# EAGLE design Aquila-2018-Under (EAGLE 9.1.1)
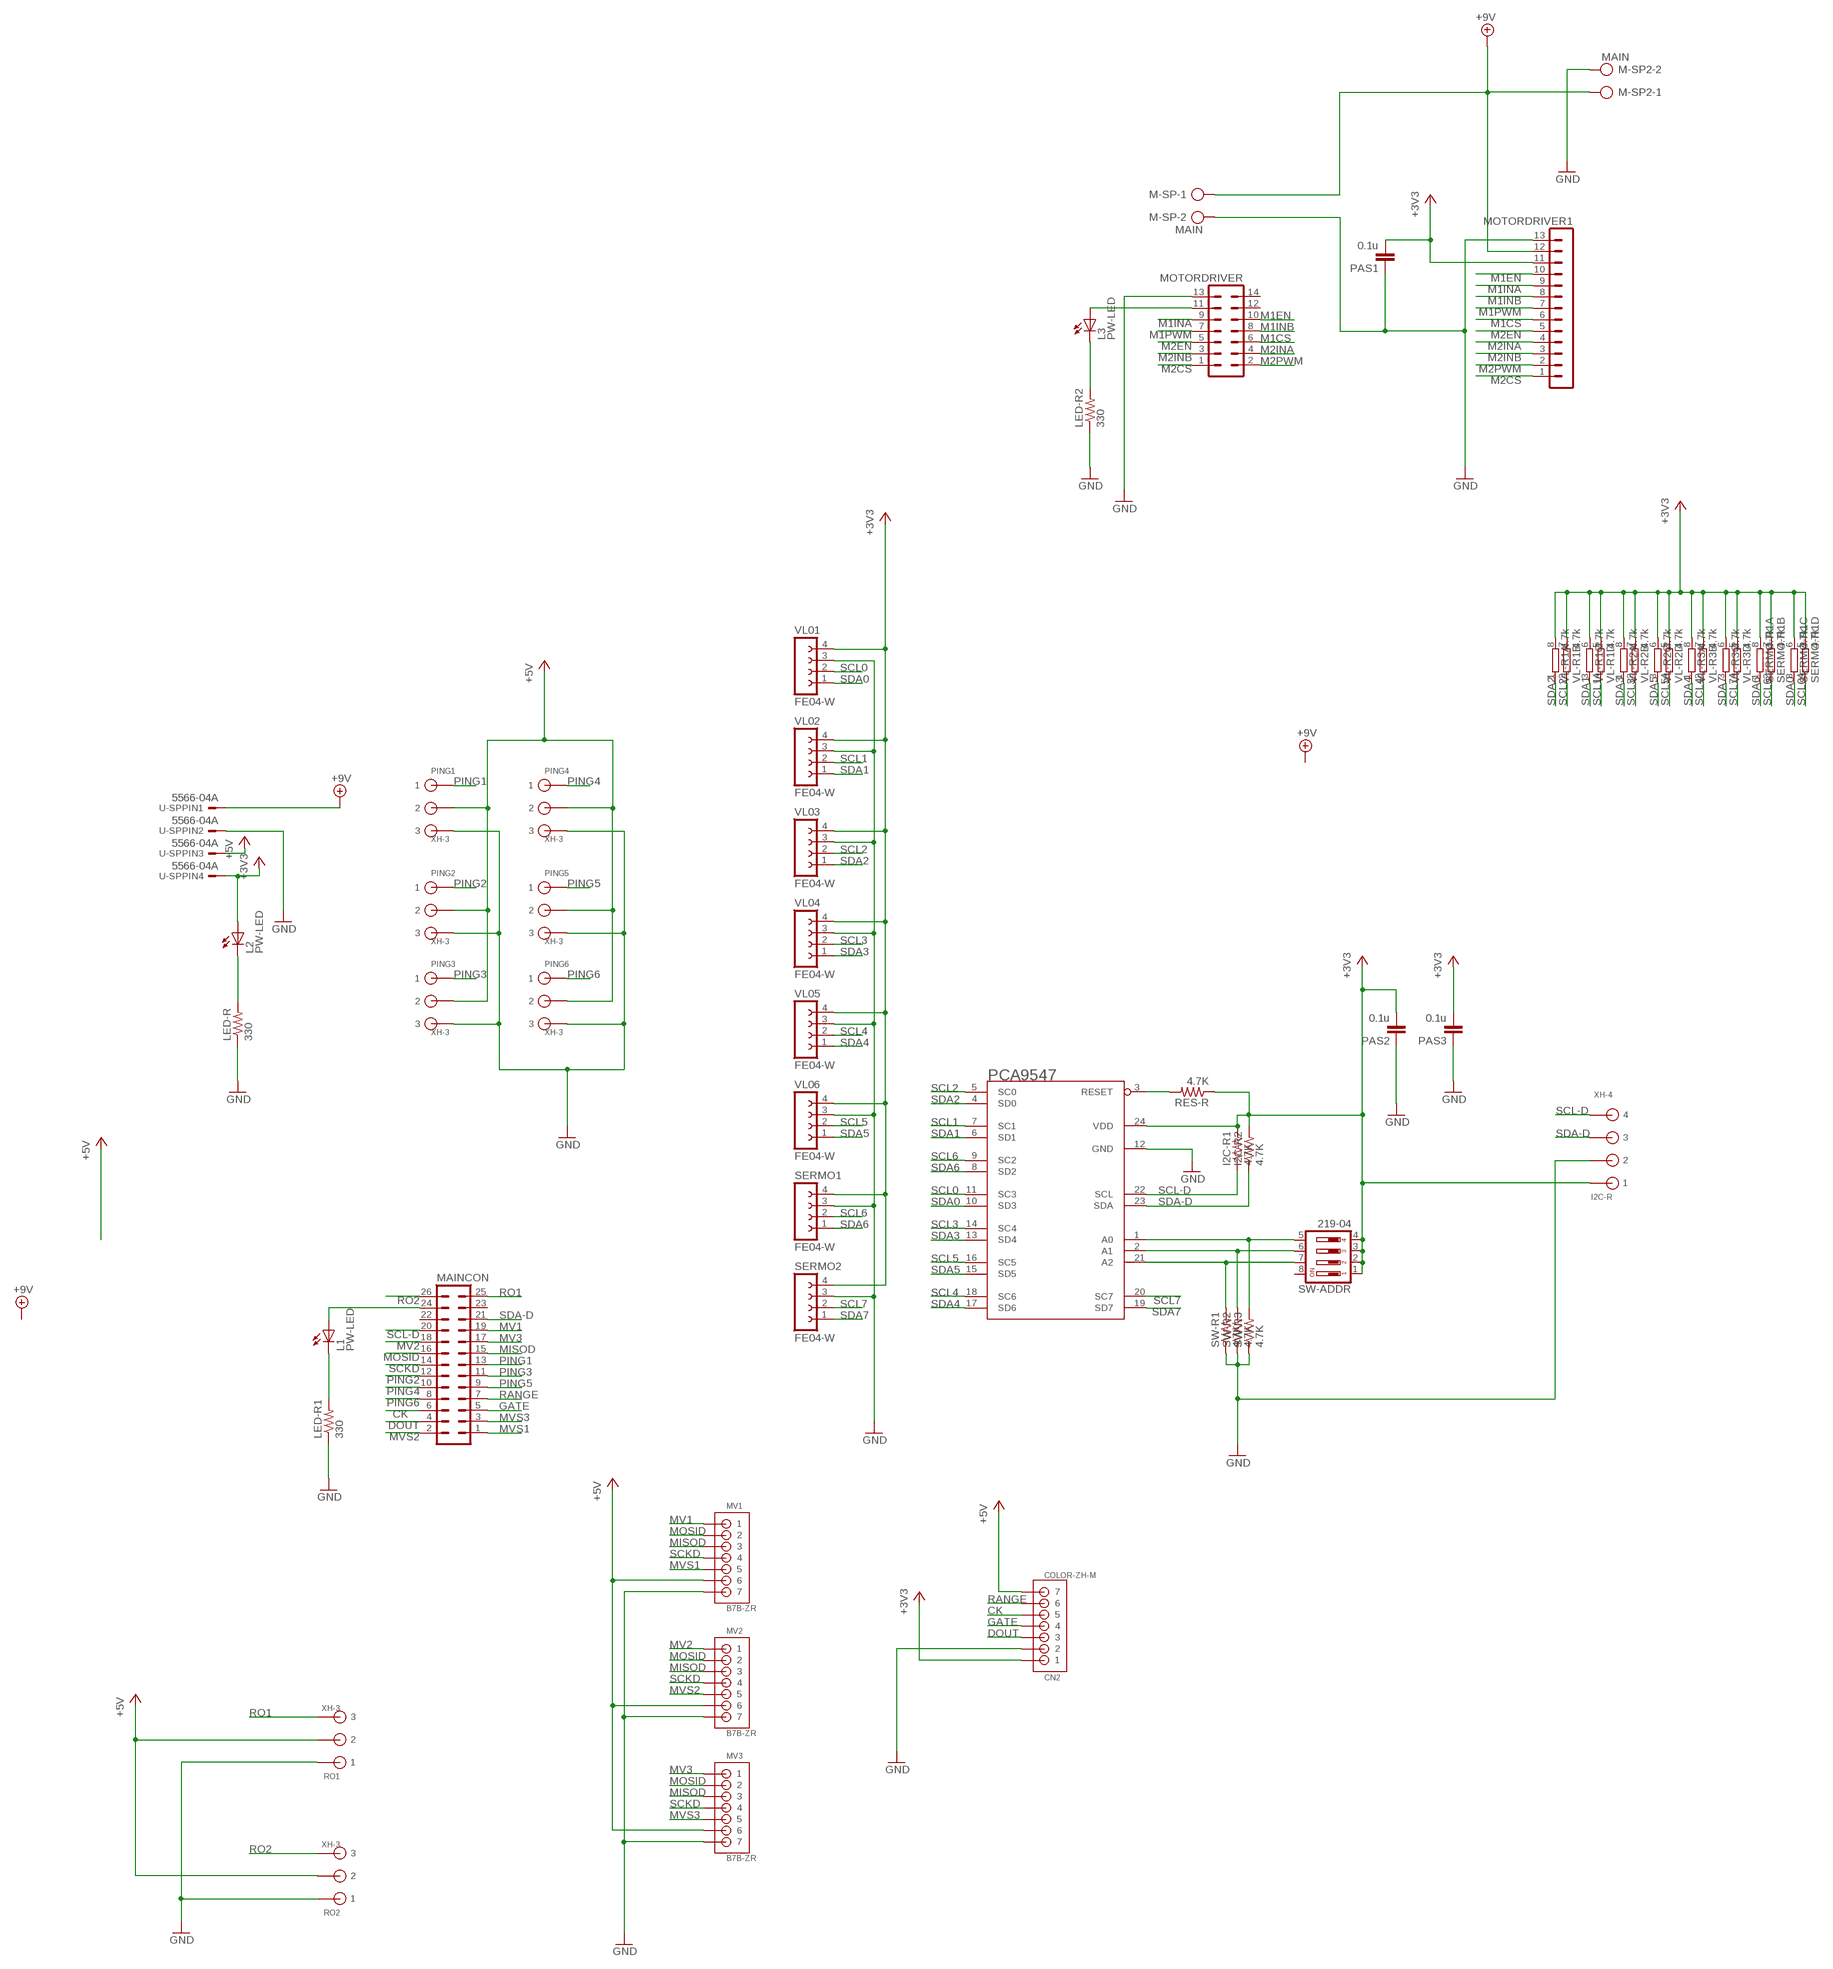
[diagram p0: schematic, sheet 1]

## Parts
CN2  COLOR-ZH-M  B7B-ZR  [B7B-ZR]
I2C-R  XH-4  [CON4]
I2C-R1  4.7K  R-US_R0805  [R0805]
I2C-R2  4.7K  R-US_R0805  [R0805]
L1  PW-LED  LEDCHIPLED_0805  [CHIPLED_0805]
L2  PW-LED  LEDCHIPLED_0805  [CHIPLED_0805]
L3  PW-LED  LEDCHIPLED_0805  [CHIPLED_0805]
LED-R  330  R-US_R0805  [R0805]
LED-R1  330  R-US_R0805  [R0805]
LED-R2  330  R-US_R0805  [R0805]
M-SP  MAIN  AK500/2  [AK500/2]
M-SP2  MAIN  AK500/2  [AK500/2]
MAINCON  ML26  [ML26]
MOTORDRIVER  ML14  [ML14]
MOTORDRIVER1  MA13-1  [MA13-1]
MV1  B7B-ZR  [B7B-ZR]
MV2  B7B-ZR  [B7B-ZR]
MV3  B7B-ZR  [B7B-ZR]
PAS1  0.1u  C-EUC0805  [C0805]
PAS2  0.1u  C-EUC0805  [C0805]
PAS3  0.1u  C-EUC0805  [C0805]
PCA9547  PCA9547  [SO24L]
PING1  XH-3  [CON3]
PING2  XH-3  [CON3]
PING3  XH-3  [CON3]
PING4  XH-3  [CON3]
PING5  XH-3  [CON3]
PING6  XH-3  [CON3]
RES-R  4.7K  R-US_R0805  [R0805]
RO1  XH-3  [CON3]
RO2  XH-3  [CON3]
SERMO1  FE04-W  [FE04-W]
SERMO2  FE04-W  [FE04-W]
SERMO-R1  4.7k  4R-NEXB28V  [EXB28V]
SW-ADDR  219-04  [CTS-219-04]
SW-R1  4.7K  R-US_R0805  [R0805]
SW-R2  4.7K  R-US_R0805  [R0805]
SW-R3  4.7K  R-US_R0805  [R0805]
U-SP  5566-04A  [5566-04A]
VL01  FE04-W  [FE04-W]
VL02  FE04-W  [FE04-W]
VL03  FE04-W  [FE04-W]
VL04  FE04-W  [FE04-W]
VL05  FE04-W  [FE04-W]
VL06  FE04-W  [FE04-W]
VL-R1  4.7k  4R-NEXB28V  [EXB28V]
VL-R2  4.7k  4R-NEXB28V  [EXB28V]
VL-R3  4.7k  4R-NEXB28V  [EXB28V]

## Nets
+3V3: CN2.1 I2C-R1.2 I2C-R2.2 I2C-R.P$1 L2.A MOTORDRIVER1.11 PAS1.2 PAS2.2 PAS3.2 PCA9547.24(VDD) RES-R.1 SERMO1.4 SERMO2.4 SERMO-R1.5 SERMO-R1.6 SERMO-R1.7 SERMO-R1.8 SW-ADDR.1 SW-ADDR.2 SW-ADDR.3 SW-ADDR.4 U-SP.4 VL01.4 VL02.4 VL03.4 VL04.4 VL05.4 VL06.4 VL-R1.5 VL-R1.6 VL-R1.7 VL-R1.8 VL-R2.5 VL-R2.6 VL-R2.7 VL-R2.8 VL-R3.5 VL-R3.6 VL-R3.7 VL-R3.8
+5V: CN2.7 MV1.6 MV2.6 MV3.6 PING1.P$2 PING2.P$2 PING3.P$2 PING4.P$2 PING5.P$2 PING6.P$2 RO1.P$2 RO2.P$2 U-SP.3
+9V: M-SP2.1 M-SP.1 MOTORDRIVER1.12 U-SP.1
CK: CN2.5 MAINCON.6
DOUT: CN2.3 MAINCON.4
GATE: CN2.4 MAINCON.5
GND: CN2.2 I2C-R.P$2 LED-R1.1 LED-R2.1 LED-R.1 M-SP2.2 M-SP.2 MOTORDRIVER1.13 MOTORDRIVER.13 MV1.7 MV2.7 MV3.7 PAS1.1 PAS2.1 PAS3.1 PCA9547.12(GND) PING1.P$3 PING2.P$3 PING3.P$3 PING4.P$3 PING5.P$3 PING6.P$3 RO1.P$1 RO2.P$1 SERMO1.3 SERMO2.3 SW-R1.1 SW-R2.1 SW-R3.1 U-SP.2 VL01.3 VL02.3 VL03.3 VL04.3 VL05.3 VL06.3
M1CS: MOTORDRIVER1.6 MOTORDRIVER.6
M1EN: MOTORDRIVER1.10 MOTORDRIVER.10
M1INA: MOTORDRIVER1.9 MOTORDRIVER.9
M1INB: MOTORDRIVER1.8 MOTORDRIVER.8
M1PWM: MOTORDRIVER1.7 MOTORDRIVER.7
M2CS: MOTORDRIVER1.1 MOTORDRIVER.1
M2EN: MOTORDRIVER1.5 MOTORDRIVER.5
M2INA: MOTORDRIVER1.4 MOTORDRIVER.4
M2INB: MOTORDRIVER1.3 MOTORDRIVER.3
M2PWM: MOTORDRIVER1.2 MOTORDRIVER.2
MISOD: MAINCON.15 MV1.3 MV2.3 MV3.3
MOSID: MAINCON.16 MV1.2 MV2.2 MV3.2
MV1: MAINCON.19 MV1.1
MV2: MAINCON.18 MV2.1
MV3: MAINCON.17 MV3.1
MVS1: MAINCON.1 MV1.5
MVS2: MAINCON.2 MV2.5
MVS3: MAINCON.3 MV3.5
N$1: PCA9547.1(A0) SW-ADDR.5 SW-R3.2
N$2: PCA9547.2(A1) SW-ADDR.6 SW-R2.2
N$3: PCA9547.21(A2) SW-ADDR.7 SW-R1.2
N$4: L2.C LED-R.2
N$5: PCA9547.3(RESET) RES-R.2
N$7: L1.C LED-R1.2
N$8: L1.A MAINCON.24
N$9: L3.C LED-R2.2
N$10: L3.A MOTORDRIVER.11
PING1: MAINCON.13 PING1.P$1
PING2: MAINCON.12 PING2.P$1
PING3: MAINCON.11 PING3.P$1
PING4: MAINCON.10 PING4.P$1
PING5: MAINCON.9 PING5.P$1
PING6: MAINCON.8 PING6.P$1
RANGE: CN2.6 MAINCON.7
RO1: MAINCON.25 RO1.P$3
RO2: MAINCON.26 RO2.P$3
SCKD: MAINCON.14 MV1.4 MV2.4 MV3.4
SCL0: PCA9547.11(SC3) SERMO-R1.4 VL01.2
SCL1: PCA9547.7(SC1) VL02.2 VL-R1.4
SCL2: PCA9547.5(SC0) VL03.2 VL-R1.2
SCL3: PCA9547.14(SC4) VL04.2 VL-R2.2
SCL4: PCA9547.18(SC6) VL05.2 VL-R3.2
SCL5: PCA9547.16(SC5) VL06.2 VL-R2.4
SCL6: PCA9547.9(SC2) SERMO1.2 SERMO-R1.2
SCL7: PCA9547.20(SC7) SERMO2.2 VL-R3.4
SCL-D: I2C-R1.1 I2C-R.P$4 MAINCON.20 PCA9547.22(SCL)
SDA0: PCA9547.10(SD3) SERMO-R1.3 VL01.1
SDA1: PCA9547.6(SD1) VL02.1 VL-R1.3
SDA2: PCA9547.4(SD0) VL03.1 VL-R1.1
SDA3: PCA9547.13(SD4) VL04.1 VL-R2.1
SDA4: PCA9547.17(SD6) VL05.1 VL-R3.1
SDA5: PCA9547.15(SD5) VL06.1 VL-R2.3
SDA6: PCA9547.8(SD2) SERMO1.1 SERMO-R1.1
SDA7: PCA9547.19(SD7) SERMO2.1 VL-R3.3
SDA-D: I2C-R2.1 I2C-R.P$3 MAINCON.21 PCA9547.23(SDA)
Unconnected: MAINCON.22 MAINCON.23 MOTORDRIVER.12 MOTORDRIVER.14 SW-ADDR.8

## Library data of the parts
CN2 MV1-MV3 = jst:B7B-ZR
I2C-R = 0@Mylibrary-main1:XH-4: Low insertion connector 4pin
I2C-R1 I2C-R2 LED-R LED-R1 LED-R2 RES-R SW-R1-SW-R3 = 0@Mylibrary-main1:R-US_: RESISTOR, American symbol
L1-L3 = led:LED: LED OSRAM: - CHIPLED LG R971, LG N971, LY N971, LG Q971, LY Q971, LO R971, LY R971 LH N974, LH R974 LS Q976, LO Q976, LY Q976 LO Q996 - Hyper CHIPLED LW Q18S LB Q993, LB Q99A, LB R99A - SideLED LS A670, LO A670, LY A670, LG A670, LP A670 LB A673, LV A673, LT A673, LW A673 LH A674 LY A675 LS A676, LA A676, LO A676, LY A676, LW A676 LS A679, LY A679, LG A679 - Hyper Micro SIDELED® LS Y876, LA Y876, LO Y876, LY Y876 LT Y87S - SmartLED LW L88C, LW L88S LB L89C, LB L89S, LG L890 LS L89K, LO L89K, LY L89K LS L896, LA L896, LO L896, LY L896 - TOPLED LS T670, LO T670, LY T670, LG T670, LP T670 LSG T670, LSP T670, LSY T670, LOP T670, LYG T670 LG T671, LOG T671, LSG T671 LB T673, LV T673, LT T673, LW T673 LH T674 LS T676, LA T676, LO T676, LY T676, LB T676, LH T676, LSB T676, LW T676 LB T67C, LV T67C, LT T67C, LS T67K, LO T67K, LY T67K, LW E67C LS E67B, LA E67B, LO E67B, LY E67B, LB E67C, LV E67C, LT E67C LW T67C LS T679, LY T679, LG T679 LS T770, LO T770, LY T770, LG T770, LP T770 LB T773, LV T773, LT T773, LW T773 LH T774 LS E675, LA E675, LY E675, LS T675 LS T776, LA T776, LO T776, LY T776, LB T776 LHGB T686 LT T68C, LB T68C - Hyper Mini TOPLED® LB M676 - Mini TOPLED Santana® LG M470 LS M47K, LO M47K, LY M47K Source: http://www.osram.convergy.de LUXEON: - LUMILED® LXK2-PW12-R00, LXK2-PW12-S00, LXK2-PW14-U00, LXK2-PW14-V00 LXK2-PM12-R00, LXK2-PM12-S00, LXK2-PM14-U00 LXK2-PE12-Q00, LXK2-PE12-R00, LXK2-PE12-S00, LXK2-PE14-T00, LXK2-PE14-U00 LXK2-PB12-K00, LXK2-PB12-L00, LXK2-PB12-M00, LXK2-PB14-N00, LXK2-PB14-P00, LXK2-PB14-Q00 LXK2-PR12-L00, LXK2-PR12-M00, LXK2-PR14-Q00, LXK2-PR14-R00 LXK2-PD12-Q00, LXK2-PD12-R00, LXK2-PD12-S00 LXK2-PH12-R00, LXK2-PH12-S00 LXK2-PL12-P00, LXK2-PL12-Q00, LXK2-PL12-R00 Source: www.luxeon.com KINGBRIGHT: KA-3528ASYC Source: www.kingbright.com
M-SP M-SP2 = con-ptr500:AK500/2: CONNECTOR; OC_FARNELL: unknown; OC_NEWARK: unknown
MAINCON = 0con-harting-ml:ML26: HARTING; OC_FARNELL: unknown; OC_NEWARK: unknown
MOTORDRIVER = 0con-harting-ml:ML14: HARTING; OC_FARNELL: unknown; OC_NEWARK: unknown
MOTORDRIVER1 = con-lstb-forprint:MA13-1: PIN HEADER; OC_FARNELL: unknown; OC_NEWARK: unknown
PAS1-PAS3 = rcl:C-EU: CAPACITOR, European symbol; SPICEPREFIX: B
PCA9547 = PCA9547:PCA9547: 8-channel I2C-Bus multiplexer with reset NXP
PING1-PING6 = 0@Mylibrary-main1:XH-3: low insertion CON
RO1 RO2 = forprint:XH-3: low insertion CON
SERMO1 SERMO2 VL01-VL06 = 0@con-lsta:FE04-W
SERMO-R1 VL-R1-VL-R3 = resistor-dil:4R-N: Array Chip Resistor Source: RS Component / Phycomp; OC_FARNELL: unknown; OC_NEWARK: unknown
SW-ADDR = switch-dil:219-04*: Surface Mount DIP Switch Series 219 SMT CTS Electronic Components Sourc: www.ctscorp.com; OC_FARNELL: unknown; OC_NEWARK: unknown
U-SP = con-molex:5566-04A

## Board
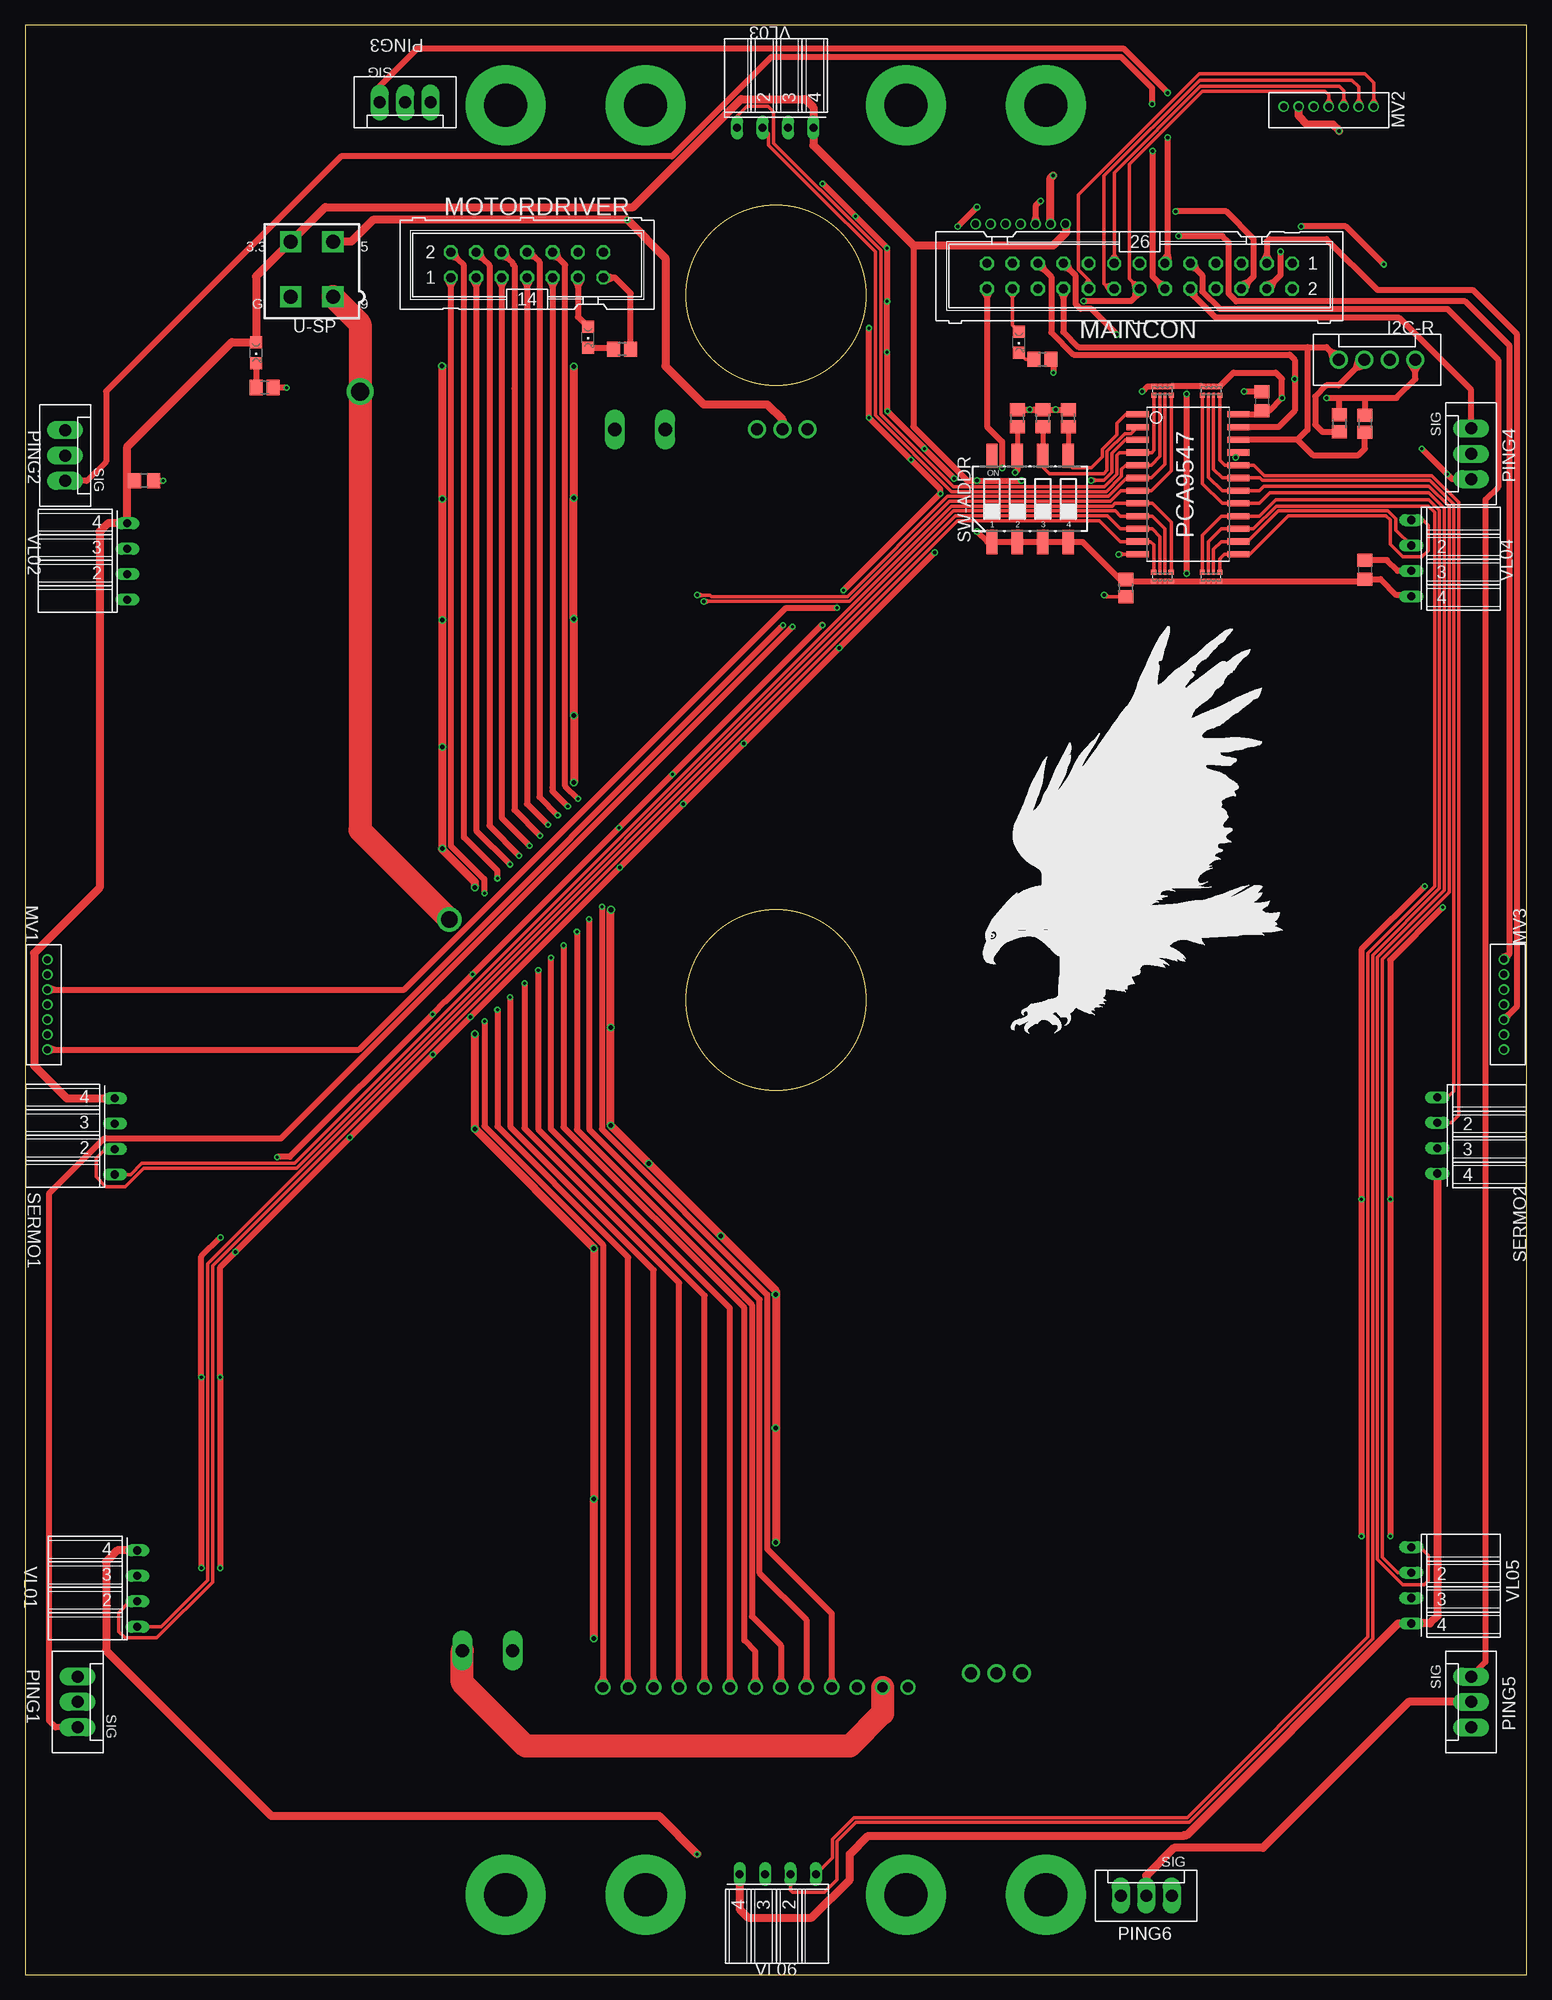
[diagram p1: board, top side]
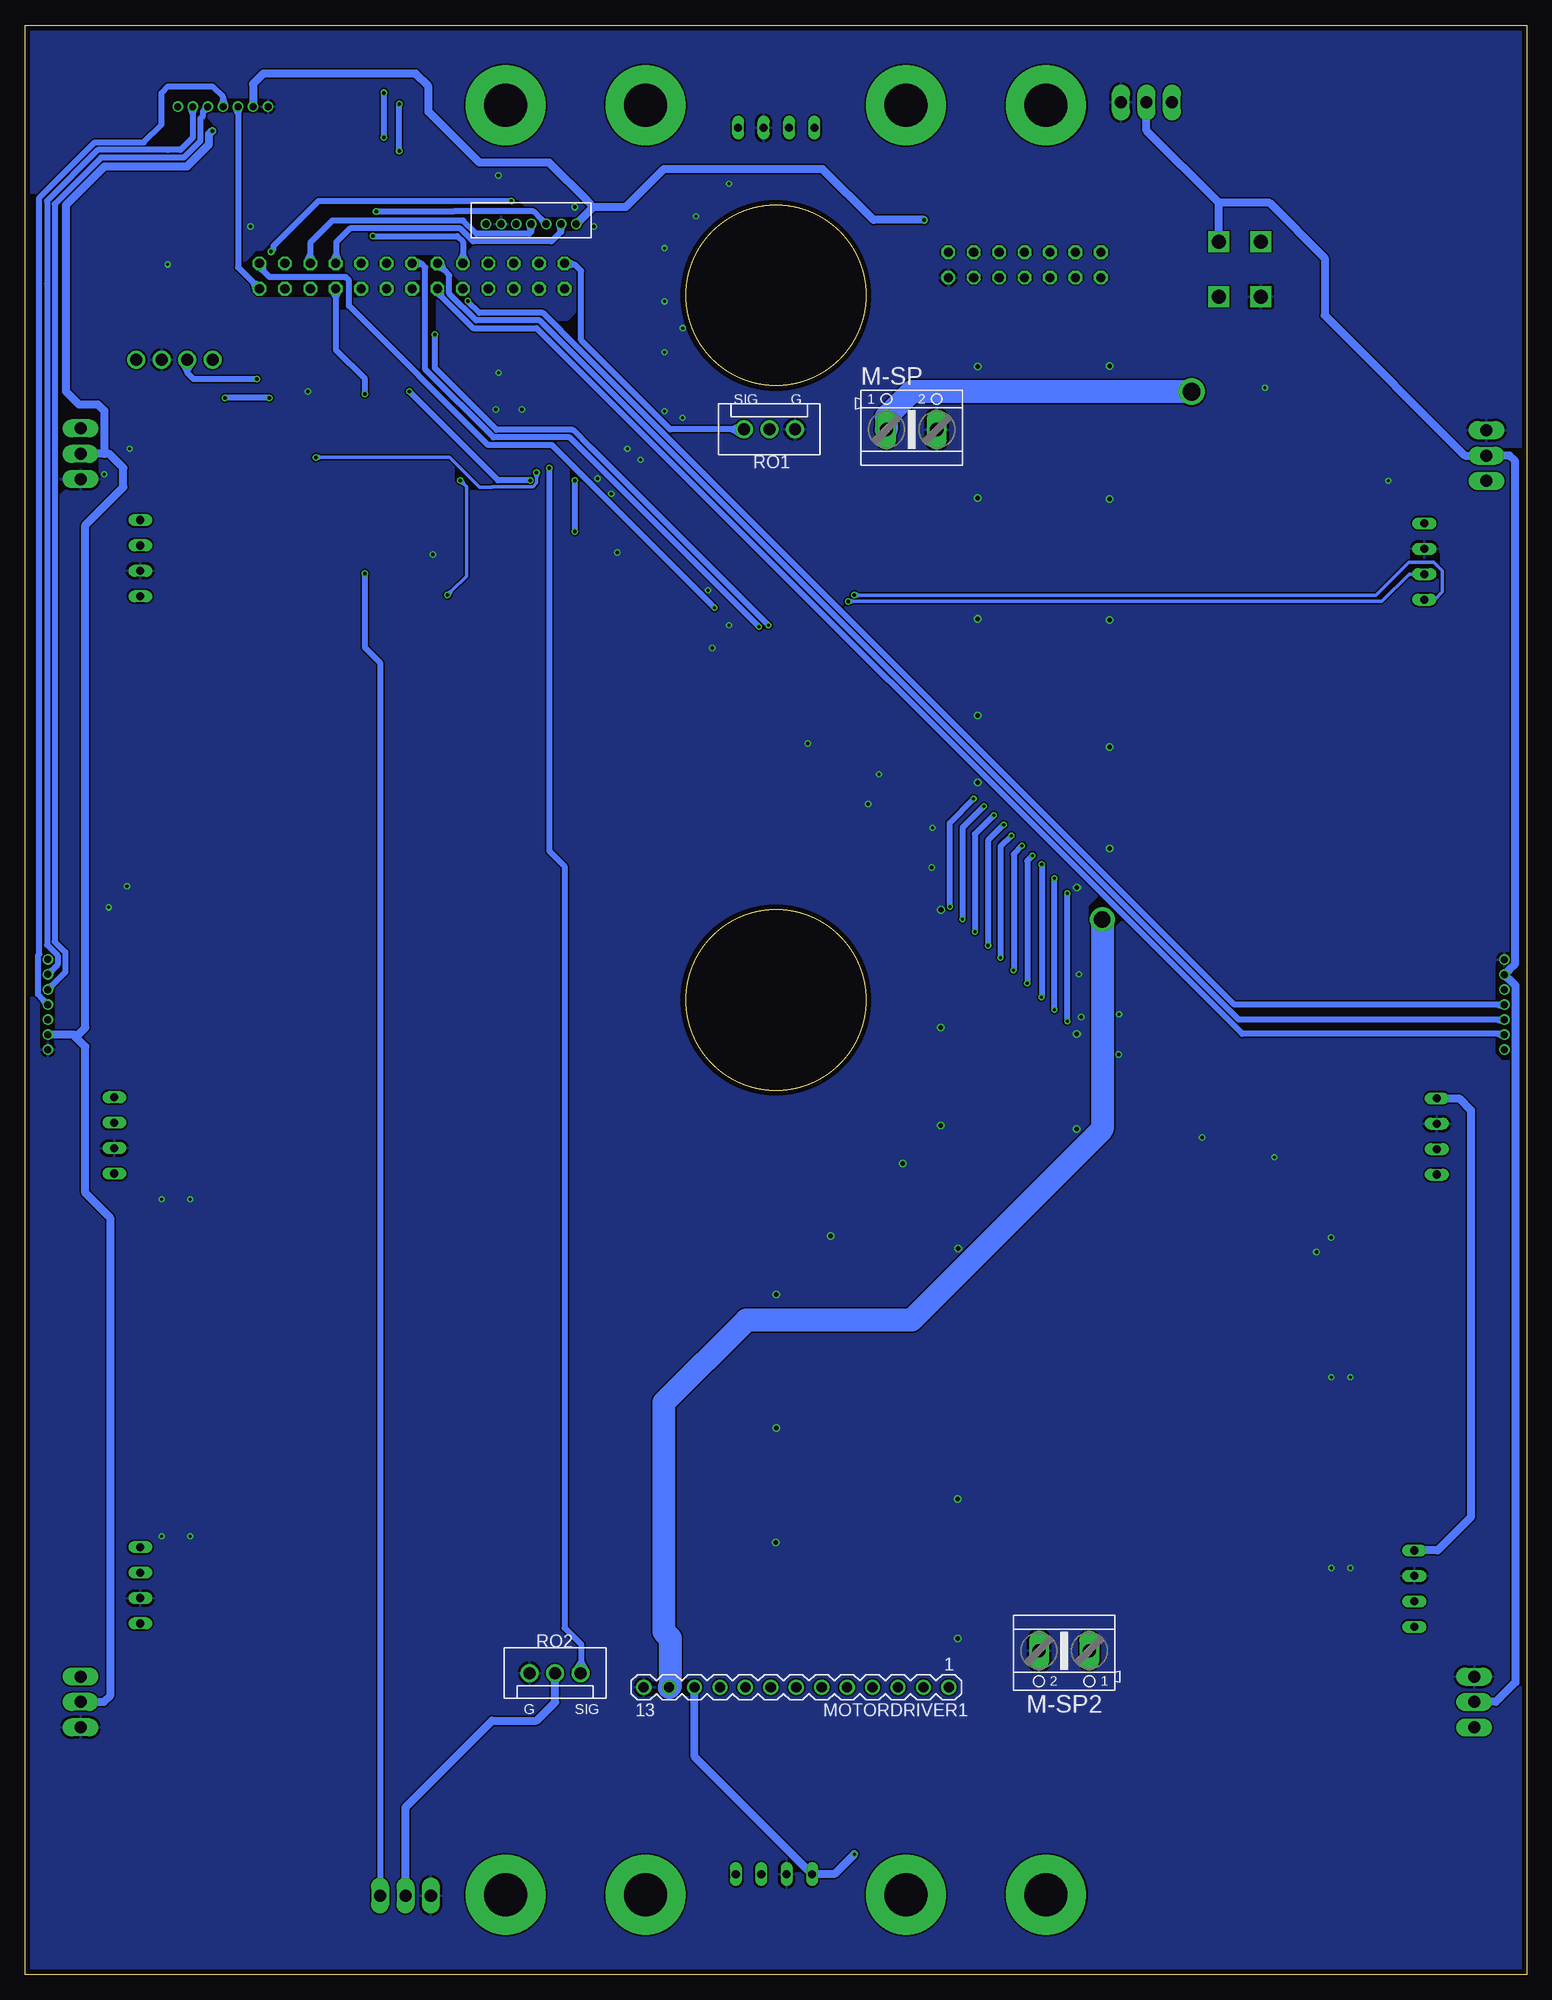
[diagram p2: board, bottom side, seen from below]

Size 150 x 194.72 mm. Coordinates in mm from the lower left corner, seen from the top.
Outline: 0,0 150,0 150,194.72 0,194.72 0,0
Outline: circle at 75,97.36 radius 9
Outline: circle at 75,167.72 radius 9
Copper layers (1*16): Top 0.035mm / dielectric 1.6mm / Bottom 0.035mm
Design rules "Elecrow_2-layer_PCB_eagle_rule": minimum track width 6mil, minimum drill 12mil, track to track 6mil, track to pad 6mil, pad to pad 6mil, via to via 8mil, smd to smd 0mil, copper to edge 20mil, drill to drill 10mil, minimum pad ring 6mil, minimum via ring 6mil, stop-mask expansion 0mil, vias tented up to drill 100mil, thermal gap 10mil
bRestrict: 69 lines

### Footprints (pad centres in the part's own frame; a part is rotated, then mirrored left to right if it is on the bottom)
B7B-ZR = drill 0.7: 1 10.5,-1.3; 2 9,-1.3; 3 7.5,-1.3; 4 6,-1.3; 5 4.5,-1.3; 6 3,-1.3; 7 1.5,-1.3
CON4 = drill 1.2: P$1 -3.81,0; P$2 -1.27,0; P$3 1.27,0; P$4 3.81,0
R0805 = smd 1.3 x 1.5: 1 -0.85,0; 2 0.85,0
CHIPLED_0805 = smd 1.2 x 1.2: A 0,-1.05; C 0,1.05
AK500/2 = drill 1.321 long: 1 -2.515,0; 2 2.515,0
ML26 = drill 0.914 octagon: 1 -15.24,-1.27; 2 -15.24,1.27; 3 -12.7,-1.27; 4 -12.7,1.27; 5 -10.16,-1.27; 6 -10.16,1.27; 7 -7.62,-1.27; 8 -7.62,1.27; 9 -5.08,-1.27; 10 -5.08,1.27; 11 -2.54,-1.27; 12 -2.54,1.27; 13 0,-1.27; 14 0,1.27; 15 2.54,-1.27; 16 2.54,1.27; 17 5.08,-1.27; 18 5.08,1.27; 19 7.62,-1.27; 20 7.62,1.27; 21 10.16,-1.27; 22 10.16,1.27; 23 12.7,-1.27; 24 12.7,1.27; 25 15.24,-1.27; 26 15.24,1.27
ML14 = drill 0.914 octagon: 1 -7.62,-1.27; 2 -7.62,1.27; 3 -5.08,-1.27; 4 -5.08,1.27; 5 -2.54,-1.27; 6 -2.54,1.27; 7 0,-1.27; 8 0,1.27; 9 2.54,-1.27; 10 2.54,1.27; 11 5.08,-1.27; 12 5.08,1.27; 13 7.62,-1.27; 14 7.62,1.27
MA13-1 = drill 1.016: 1 -15.24,0; 2 -12.7,0; 3 -10.16,0; 4 -7.62,0; 5 -5.08,0; 6 -2.54,0; 7 0,0; 8 2.54,0; 9 5.08,0; 10 7.62,0; 11 10.16,0; 12 12.7,0; 13 15.24,0
C0805 = smd 1.3 x 1.5: 1 -0.95,0; 2 0.95,0
SO24L = smd 0.61 x 2.21: 1 -6.985,-5.029; 2 -5.715,-5.029; 3 -4.445,-5.029; 4 -3.175,-5.029; 5 -1.905,-5.029; 6 -0.635,-5.029; 7 0.635,-5.029; 8 1.905,-5.029; 9 3.175,-5.029; 10 4.445,-5.029; 11 5.715,-5.029; 12 6.985,-5.029; 13 6.985,5.029; 14 5.715,5.029; 15 4.445,5.029; 16 3.175,5.029; 17 1.905,5.029; 18 0.635,5.029; 19 -0.635,5.029; 20 -1.905,5.029; 21 -3.175,5.029; 22 -4.445,5.029; 23 -5.715,5.029; 24 -6.985,5.029
CON3 = drill 1.2 long: P$1 -2.54,0; P$2 0,0; P$3 2.54,0
CON3' = drill 1.2: P$1 -2.54,0; P$2 0,0; P$3 2.54,0
FE04-W = drill 0.813 long: 1 1.27,-1.27; 2 3.81,-1.27; 3 6.35,-1.27; 4 8.89,-1.27
EXB28V = smd 0.525 x 0.5: 1 -0.875,-0.45; 4 0.875,-0.45; 5 0.875,0.45; 8 -0.875,0.45 | smd 0.25 x 0.5: 2 -0.25,-0.45; 3 0.25,-0.45; 6 0.25,0.45; 7 -0.25,0.45
CTS-219-04 = smd 1.13 x 2.44: 1 -3.81,-4.3; 2 -1.27,-4.3; 3 1.27,-4.3; 4 3.81,-4.3; 5 3.81,4.3; 6 1.27,4.3; 7 -1.27,4.3; 8 -3.81,4.3
5566-04A = drill 1.4 square: 1 2.1,-2.75; 2 -2.1,-2.75; 3 2.1,2.75; 4 -2.1,2.75

### Placement (x,y rotation side)
CN2  93.44,173.55 180 bottom
I2C-R  135.06,161.31 180 top
I2C-R1  133.86,154.93 90 top
I2C-R2  131.28,154.94 90 top
L1  99.28,163.07 180 top
L2  23.08,162.01 180 top
L3  56.24,163.53 180 top
LED-R  23.93,158.53 180 top
LED-R1  101.64,161.34 180 top
LED-R2  59.66,162.37 180 top
M-SP  61.44,154.33 0 bottom
M-SP2  46.2,32.38 180 bottom
MAINCON  111.34,169.65 180 top
MOTORDRIVER  50.15,170.77 0 top
MOTORDRIVER1  72.96,28.73 180 bottom
MV1  3.53,102.9 270 top
MV2  124.23,187.88 0 top
MV3  146.42,90.91 90 top
PAS1  133.82,140.34 270 top
PAS2  123.56,157.16 270 top
PAS3  11.9,149.22 180 top
PCA9547  116.17,148.86 270 top
PING1  5.25,27.26 90 top
PING2  4.01,151.73 90 top
PING3  37.97,187 0 top
PING4  144.45,151.91 270 top
PING5  144.45,27.26 270 top
PING6  112,7.92 180 top
RES-R  109.97,138.5 270 top
RO1  XH-3  [CON3']  75.64,154.35 180 bottom
RO2  XH-3  [CON3']  97.05,30.15 0 bottom
SERMO1  7.7,78.66 90 top
SERMO2  142.35,88.92 270 top
SERMO-R1  113.62,139.63 180 top
SW-ADDR  100.39,147.41 0 top
SW-R1  99.12,155.47 270 top
SW-R2  101.66,155.47 270 top
SW-R3  104.21,155.47 270 top
U$1  [EAGLE-PLC-30MM]  95.72,93.98 0 top
U-SP  28.66,170.34 0 top
VL01  9.95,33.5 90 top
VL02  8.95,136.07 90 top
VL03  69.87,185.75 0 top
VL04  139.75,146.56 270 top
VL05  139.75,43.99 270 top
VL06  80.27,8.8 180 top
VL-R1  113.63,158.2 0 top
VL-R2  118.47,139.62 180 top
VL-R3  118.48,158.2 0 top

### Tracks (layer width: path | path; a pad name or v marks a point on that pad's centre or on a via)
+3V3  (via drill 0.3, 0.35)
  Top 0.33: PAS3.2 10.22,149.22
  Top 0.61: VL-R2.5 114.51,139.17 SERMO-R1.8 SERMO-R1.7 SERMO-R1.6 SERMO-R1.5 110.14,139.18 RES-R.1 109.41,139.35 105.64,143.12 SW-ADDR.4 SW-ADDR.3 SW-ADDR.2 97.63,143.12 97,143.12 | VL-R2.5 VL-R2.6 VL-R2.8 133.61,139.17 PAS1.2 135.41,139.38 137,137.79 138.35,137.79 VL04.4 | VL-R2.5 VL-R2.7 | VL-R1.8 112.87,158.65 | 112.87,158.65 VL-R1.7 | VL-R1.7 VL-R1.6 | VL-R1.7 VL-R1.5 VL-R3.8 VL-R3.7 VL-R3.6 VL-R3.5 120.73,160.02 124.94,160.02 125.57,159.38 v125.57,157.48 124.3,156.21 PAS2.2 123.2,155.84 PCA9547.24 | SW-ADDR.1 97,143.12 | 138.87,160.11 138.87,159.42 138.91,159.38 137,157.48 133.82,157.48 | 138.87,160.11 I2C-R.P$1 | v130.01,157.48 131.28,157.48 | 131.28,157.48 133.82,157.48 | I2C-R2.2 131.28,157.48 | 133.82,157.48 133.86,157.45 I2C-R1.2 | v111.6,158.12 112.13,158.65 112.87,158.65 | 88.74,172.72 88.74,154.62 94.12,149.24 94.45,149.24 | v99.53,149.26 99.51,149.24 94.45,149.24 | 94.45,149.24 95.07,149.24 v95.09,149.26 | v95.09,144.15 96.12,143.12 97,143.12 | 138.87,160.11 139.39,161.02 I2C-R.P$1 | 138.87,160.11 138.35,161.02 I2C-R.P$1
  Top 0.813: SERMO1.4 4.17,87.55 0.91,90.81 0.91,102.04 7.46,108.58 7.46,144.15 8.28,144.96 VL02.4 10.22,149.22 10.22,152.62 20.66,163.06 L2.A 23.08,169.62 U-SP.4 29.99,176.53 60.75,176.53 71.55,187.32 77.94,187.32 78.76,186.51 VL03.4 78.76,182.7 84.3,177.16 | VL01.4 9.21,42.39 8.1,41.27 8.1,32.38 24.61,15.88 63.34,15.88 v67.15,12.06 | VL06.4 71.38,6.57 72.23,5.71 78.58,5.71 82.39,9.53 82.39,12.06 84.21,13.88 115.71,13.88 115.8,13.97 116.05,13.97 137.18,35.1 VL05.4 140.35,35.1 141.08,35.83 SERMO2.4 | CN2.1 103.98,174.82 103.98,173.99 102.71,172.72 88.74,172.72 | 84.3,177.16 | 84.3,177.16 88.74,172.72 | 88.74,172.72
  Bottom 0.61: v125.57,157.48 v130.01,157.48 | v111.6,158.12 102.75,149.26 v99.53,149.26 | v95.09,149.26 v95.09,144.15
  Bottom 0.813: SERMO1.4 6.75,87.55 5.55,86.36 5.55,45.72 8.88,42.39 VL01.4 | v67.15,12.06 69.15,10.07 VL06.4 83.12,21.81 MOTORDRIVER1.11
+5V  (via drill 0.35)
  Top 0.813: PING5.P$2 138.22,27.26 123.67,12.7 114.78,12.7 112,9.93 PING6.P$2 | U-SP.3 32.6,173.09 34.77,175.26 v60.16,175.26 63.98,171.45 63.98,160.66 67.78,156.84 74.14,156.84 75.64,155.34 RO1.P$2 | MV2.6 127.23,185.66 128.11,184.78 130.65,184.78 v131.28,184.15
  Bottom 0.813: U-SP.3 30.75,176.97 | PING3.P$2 37.97,184.18 30.75,176.97 | 30.75,176.97 25.68,176.97 20.16,171.45 20.16,165.74 6.16,151.73 PING2.P$2 1.71,151.73 1.15,151.17 1.15,100.95 1.78,100.32 1.81,100.32 MV1.6 1.81,99.48 1.78,99.48 1.11,98.81 1.11,29.21 3.06,27.26 PING1.P$2 | PING5.P$2 142.12,27.26 141.44,27.94 141.44,75.56 143.99,78.11 143.99,92.71 145.19,93.91 | 145.19,93.91 MV3.6 | 145.19,93.91 144.69,93.91 143.99,94.61 143.99,144.78 140.18,148.59 140.18,150.5 141.59,151.91 142.08,151.91 | 142.08,151.91 PING4.P$2 | MV2.6 127.23,188.84 126.2,189.87 110.97,189.87 109.69,188.59 109.69,186.06 104.61,180.97 97.63,180.97 93.82,177.16 93.19,176.53 | 142.08,151.91 142.08,156.21 142.72,156.84 144.62,156.84 145.89,158.12 145.89,176.77 142.04,180.62 133.79,180.62 131.6,182.8 131.6,183.83 v131.28,184.15 | CN2.7 93.27,176.53 93.19,176.53 | RO2.P$2 97.05,27.25 98.9,25.4 103.34,25.4 112,16.75 PING6.P$2 | v60.16,175.26 65.25,175.26 70.33,180.34 86.2,180.34 90.01,176.53 93.19,176.53
+9V  (via drill 1.65, 1.78)
  Top 2.286: U-SP.1 33.47,164.88 v33.47,158.12 33.47,114.33 | 33.47,114.33 | v42.38,105.41 33.47,114.33 | MOTORDRIVER1.12 85.66,26.13 82.39,22.86 50.01,22.86 43.68,29.18 M-SP2.1
  Bottom 2.286: 86.2,43.81 86.2,57.15 77.94,65.41 61.44,65.41 42.38,84.45 v42.38,105.41 | 86.2,43.81 | 86.2,43.81 86.2,34.29 85.56,33.66 85.56,28.82 MOTORDRIVER1.12 | v33.47,158.12 61.44,158.12 63.95,155.6 M-SP.1
CK  (via drill 0.35)
  Top 0.61: v114.92,176.11 119.98,176.11 122.72,173.37 122.72,169.6 122.15,169.03 | 122.15,169.03 MAINCON.6 | 122.15,169.03 121.37,168.74 MAINCON.6 | 122.15,169.03 121.86,168.25 MAINCON.6
  Bottom 0.61: v114.92,176.11 107.16,176.11 99.2,176.11 98.44,175.35 | CN2.5 98.44,175.35 | 98.44,175.35 97.84,175.05 CN2.5 | 98.44,175.35 98.14,174.76 CN2.5
DOUT  (via drill 0.35)
  Top 0.61: v125.41,172.09 125.41,169.75 124.69,169.03 | 124.69,169.03 MAINCON.4 | v101.44,177.16 100.94,176.67 100.94,175.56 | 100.94,175.56 CN2.3 | 124.69,169.03 123.91,168.74 MAINCON.4 | 124.69,169.03 124.4,168.25 MAINCON.4 | 100.94,175.56 100.73,174.92 CN2.3 | 100.94,175.56 101.15,174.92 CN2.3
  Bottom 0.61: v125.41,172.09 125.18,172.32 125.18,172.66 120.68,177.16 v101.44,177.16
GATE
  Bottom 0.61: 121.5,171.83 121.5,172.98 119.3,175.18 106.22,175.18 104.91,173.87 99.65,173.87 99.44,174.08 99.44,174.16 | 121.5,171.83 MAINCON.5 | CN2.4 99.44,174.16 | 121.5,171.83 121.15,171.08 MAINCON.5 | 121.5,171.83 121.85,171.08 MAINCON.5 | 99.44,174.16 99.65,174.78 CN2.4 | 99.44,174.16 99.23,174.78 CN2.4
GND  (via drill 0.3, 0.35, 0.45, 0.5)
  Top 0.33: PCA9547.12 109.79,141.88 | 109.79,141.88 v109.27,141.88 v109.26,141.87 | 109.79,141.88 109.31,142.03 v109.26,141.87 | 109.79,141.88 109.31,141.72 v109.26,141.87
  Top 0.61: v141.62,106.6 136.37,101.35 v136.37,77.47 v136.37,43.81 | v139.82,108.74 133.51,102.42 v133.51,77.47 v133.51,43.81 | v17.62,40.64 v17.62,59.69 17.62,71.75 v19.52,73.66 | v19.51,40.64 v19.51,59.69 19.51,70.69 v21.01,72.18 v32.44,83.61 v40.76,91.94 v44.5,95.67 v59.42,110.6 v65.77,116.95 v71.81,122.98 v81.33,132.5 v90.86,142.03 | v81.75,138.26 91.41,147.92 v91.43,147.92 91.43,148.37 84.31,155.5 84.31,164.45 v84.3,164.47 | LED-R2.1 60.51,167.93 58.94,169.5 58.68,169.5 | 58.68,169.5 MOTORDRIVER.13 | v135.73,170.81 131.92,174.62 v127.47,174.62 | LED-R1.1 102.71,161.12 v102.71,160.02 | LED-R.1 v26.12,158.53 v26.13,158.52 | SW-R1.1 100.81,156.32 | 100.81,156.32 SW-R2.1 SW-R3.1 | PAS3.1 v13.81,149.22 | v139.54,152.4 v142.08,149.86 142.57,149.37 PING4.P$3 | v86.11,162.05 86.12,162.06 | 86.12,162.06 v86.12,167.12 86.12,172.44 v86.11,172.45 86.11,172.48 v82.97,175.62 79.7,178.89 v79.67,178.89 | 86.12,162.06 86.14,162.05 v86.14,156.15 89.83,152.45 v89.83,152.43 v92.82,149.44 | VL04.3 137.12,140.21 136.05,141.28 PAS1.1 | PAS2.1 v121.76,158.12 | v25.19,81.67 25.21,81.7 26.46,81.7 v40.71,95.95 41.98,97.22 41.99,97.22 v44.71,99.94 45.34,100.57 45.36,100.57 58.44,113.65 v59.35,114.58 59.71,114.92 v64.7,119.91 79.63,134.84 v79.68,134.79 | v100.37,156.32 100.8,156.32 100.81,156.32 | v95.09,176.53 v93.19,174.62 | 58.68,169.5 57.93,169.85 MOTORDRIVER.13 | 58.68,169.5 57.93,169.15 MOTORDRIVER.13
  Top 0.813: v41.66,160.68 41.66,112.42 44.92,109.16 v44.92,108.58 | v56.84,33.58 v56.84,47.55 56.84,72.58 v44.94,84.48 44.94,93.97 v44.92,93.98 | v54.82,160.63 v54.82,147.47 v54.82,135.43 54.83,135.42 v54.83,125.79 v54.83,119.09 | v102.71,179.71 102.44,179.44 CN2.2 | v58.53,106.39 58.51,106.37 v58.51,94.6 v58.51,84.84 62.32,81.03 v62.32,81.01 69.51,73.83 v69.51,73.8 75,68.31 v75,43.18
  other vias: 84.31,155.51 88.5,151.3 41.67,112.47 41.67,122.63 41.67,135.33 41.67,147.4 74.97,54.61 74.97,67.94 56.8,72.54 102.96,156.31
  pour Bottom: 151,195 151,-1 0,-1 0,195
M1CS  (via drill 0.3)
  Top 0.61: MOTORDRIVER.6 48.26,171.39 | 48.26,171.39 48.73,170.91 48.73,170.81 48.89,170.66 48.89,158.41 48.89,116.36 v51.47,113.78 | v52.55,101.6 52.55,84.45 70.42,66.58 70.42,29.75 | MOTORDRIVER1.6 70.42,29.75 | 48.26,171.39 47.97,172.17 MOTORDRIVER.6 | 48.26,171.39 47.48,171.68 MOTORDRIVER.6 | 70.42,29.75 70.01,28.94 MOTORDRIVER1.6 | 70.42,29.75 70.83,28.94 MOTORDRIVER1.6
  Bottom 0.61: v51.47,113.78 52.55,112.7 v52.55,101.6
M1EN  (via drill 0.3)
  Top 0.61: MOTORDRIVER.10 53.34,171.39 | 53.34,171.39 53.95,170.78 53.95,118.75 53.95,118.73 v55.24,117.45 | v57.62,106.68 57.62,84.45 74.14,67.94 74.14,42.55 80.58,36.1 80.58,29.75 | 80.58,29.75 MOTORDRIVER1.10 | 53.34,171.39 53.05,172.17 MOTORDRIVER.10 | 53.34,171.39 52.56,171.68 MOTORDRIVER.10 | 80.58,29.75 80.17,28.94 MOTORDRIVER1.10 | 80.58,29.75 80.99,28.94 MOTORDRIVER1.10
  Bottom 0.61: v57.62,106.68 57.62,115.06 v55.24,117.45
M1INA  (via drill 0.3)
  Top 0.61: MOTORDRIVER.9 52.69,168.59 | 52.69,168.59 52.69,118.6 | v56.35,105.44 56.35,84.45 73.37,67.44 73.37,40.13 78.04,35.47 78.04,29.75 | 52.69,118.6 | 52.69,118.6 52.69,118.23 v54.22,116.7 | 78.04,29.75 MOTORDRIVER1.9 | 52.69,168.59 53.04,169.34 MOTORDRIVER.9 | 52.69,168.59 52.34,169.34 MOTORDRIVER.9 | 78.04,29.75 77.63,28.94 MOTORDRIVER1.9 | 78.04,29.75 78.45,28.94 MOTORDRIVER1.9
  Bottom 0.61: v54.22,116.7 56.35,114.57 v56.35,105.44
M1INB  (via drill 0.3)
  Top 0.61: MOTORDRIVER.8 50.43,172.04 50.92,171.55 | 50.92,171.55 51.39,171.08 51.39,117.65 v53.22,115.82 | v55.12,104.17 55.12,84.42 71.91,67.63 72.61,66.93 72.61,35.81 75.5,32.92 75.5,29.75 | 75.5,29.75 MOTORDRIVER1.8 | 50.92,171.55 50.47,172.25 MOTORDRIVER.8 | 50.92,171.55 50.1,171.66 MOTORDRIVER.8 | 75.5,29.75 75.09,28.94 MOTORDRIVER1.8 | 75.5,29.75 75.91,28.94 MOTORDRIVER1.8
  Bottom 0.61: v53.22,115.82 55.12,113.92 v55.12,104.17
M1PWM  (via drill 0.3)
  Top 0.61: MOTORDRIVER.7 50.15,168.59 | 50.15,168.59 50.15,116.94 v52.24,114.85 | v53.79,102.81 53.79,84.67 71.85,66.61 71.85,33.4 72.96,32.29 72.96,29.75 | MOTORDRIVER1.7 72.96,29.75 | 50.15,168.59 50.5,169.34 MOTORDRIVER.7 | 50.15,168.59 49.8,169.34 MOTORDRIVER.7 | 72.96,29.75 72.55,28.94 MOTORDRIVER1.7 | 72.96,29.75 73.37,28.94 MOTORDRIVER1.7
  Bottom 0.61: v52.24,114.85 53.79,113.3 v53.79,102.81
M2CS  (via drill 0.3)
  Top 0.61: MOTORDRIVER.1 42.53,168.59 | 42.53,168.59 42.53,112.78 45.83,109.49 | v45.89,95.22 45.89,84.76 57.72,72.93 57.72,29.75 | 45.83,109.49 | v45.89,108.04 45.89,109.42 45.83,109.49 | 57.72,29.75 MOTORDRIVER1.1 | 42.53,168.59 42.88,169.34 MOTORDRIVER.1 | 42.53,168.59 42.18,169.34 MOTORDRIVER.1 | 57.72,29.75 57.31,28.94 MOTORDRIVER1.1 | 57.72,29.75 58.13,28.94 MOTORDRIVER1.1
  Bottom 0.61: v45.89,95.22 v45.89,108.04
M2EN  (via drill 0.3)
  Top 0.61: MOTORDRIVER.5 47.61,168.59 | 47.61,168.59 47.61,115.54 v50.4,112.75 | v51.27,100.33 51.27,84.45 67.88,67.85 67.88,29.75 | MOTORDRIVER1.5 67.88,29.75 | 47.61,168.59 47.96,169.34 MOTORDRIVER.5 | 47.61,168.59 47.26,169.34 MOTORDRIVER.5 | 67.88,29.75 67.47,28.94 MOTORDRIVER1.5 | 67.88,29.75 68.29,28.94 MOTORDRIVER1.5
  Bottom 0.61: v50.4,112.75 51.24,111.91 51.24,100.32 51.26,100.32 v51.27,100.33
M2INA  (via drill 0.3)
  Top 0.61: MOTORDRIVER.4 45.72,171.39 | 45.72,171.39 46.39,170.72 46.39,114.77 v49.37,111.78 | v49.89,99.02 49.89,84.57 64.93,69.53 | 64.93,69.53 65.34,69.12 | MOTORDRIVER1.4 65.34,29.75 | 65.34,29.75 65.34,69.12 | 65.34,69.12 64.93,69.53 | 45.72,171.39 45.43,172.17 MOTORDRIVER.4 | 45.72,171.39 44.94,171.68 MOTORDRIVER.4 | 65.34,29.75 64.93,28.94 MOTORDRIVER1.4 | 65.34,29.75 65.75,28.94 MOTORDRIVER1.4
  Bottom 0.61: v49.37,111.78 49.89,111.27 v49.89,99.02
M2INB  (via drill 0.3)
  Top 0.61: MOTORDRIVER.3 45.07,168.59 | 45.07,168.59 45.07,114.27 v48.44,110.9 | v48.47,97.65 48.47,84.72 62.8,70.39 62.8,29.75 | MOTORDRIVER1.3 62.8,29.75 | 45.07,168.59 45.42,169.34 MOTORDRIVER.3 | 45.07,168.59 44.72,169.34 MOTORDRIVER.3 | 62.8,29.75 62.39,28.94 MOTORDRIVER1.3 | 62.8,29.75 63.21,28.94 MOTORDRIVER1.3
  Bottom 0.61: v48.44,110.9 48.44,97.68 v48.47,97.65
M2PWM  (via drill 0.3)
  Top 0.61: MOTORDRIVER.2 43.18,171.39 | 43.18,171.39 43.85,170.72 43.85,113.61 47.19,110.27 v47.19,109.5 | v47.19,96.41 47.19,84.73 58.58,73.34 59.53,72.39 | 60.26,71.66 59.53,72.39 | MOTORDRIVER1.2 60.26,29.75 | 60.26,29.75 60.26,71.66 | 60.26,71.66 59.53,72.39 | 43.18,171.39 42.89,172.17 MOTORDRIVER.2 | 43.18,171.39 42.4,171.68 MOTORDRIVER.2 | 60.26,29.75 59.85,28.94 MOTORDRIVER1.2 | 60.26,29.75 60.67,28.94 MOTORDRIVER1.2
  Bottom 0.61: v47.19,96.41 v47.19,109.5
MISOD
  Top 0.33: MV2.3 131.73,187.28 | 131.73,187.28 131.73,188.15 131.28,188.59 117.41,188.59 108.8,179.99 108.8,171.83 | 108.8,171.83 MAINCON.15 | 108.8,171.83 108.37,171.22 MAINCON.15 | 108.8,171.83 109.23,171.22 MAINCON.15 | 131.73,187.28 131.42,186.76 MV2.3 | 131.73,187.28 132.04,186.76 MV2.3
  Bottom 0.61: MV1.3 2.93,95.4 | 2.93,95.4 28.76,95.4 51.37,118.01 98.04,164.69 | 98.04,164.69 | 98.04,164.69 98.58,165.23 104.93,165.23 107.61,167.91 107.61,169.73 108.15,170.27 | 147.22,98.91 145.98,100.15 145.98,102.13 147.03,103.19 147.03,176.85 142.4,181.48 134.14,181.48 132.47,183.16 | 147.22,98.91 MV3.3 | MV2.3 132.22,186.09 | 108.15,170.27 MAINCON.15 | 108.15,170.27 108.93,170.56 MAINCON.15 | 108.15,170.27 108.44,171.05 MAINCON.15 | 147.22,98.91 147.52,98.31 MV3.3 | 147.22,98.91 147.82,98.61 MV3.3 | 132.22,186.09 131.93,186.68 MV2.3 | 132.22,186.09 131.63,186.38 MV2.3 | 2.93,95.4 2.3,95.61 MV1.3 | 2.93,95.4 2.3,95.19 MV1.3 | 132.47,183.16 | 132.22,186.09 132.22,185.64 132.47,185.39 132.47,183.16
MOSID
  Top 0.33: MV2.2 133.23,187.28 | 133.23,187.28 133.23,188.56 132.56,189.23 117.36,189.23 107.79,179.66 107.79,168.91 107.96,168.74 | 107.96,168.74 108.32,168.38 MAINCON.16 | 107.96,168.74 108.36,168.1 MAINCON.16 | 107.96,168.74 108.7,168.89 MAINCON.16 | 133.23,187.28 132.92,186.76 MV2.2 | 133.23,187.28 133.54,186.76 MV2.2
  Bottom 0.61: MV1.2 2.31,93.98 2.92,93.98 | 2.92,93.98 28.41,93.98 98.9,164.47 105.25,164.47 108.36,167.58 | MV2.2 133.23,185.88 | 133.23,185.88 133.23,183.47 134.46,182.25 135.73,182.25 142.72,182.25 147.79,177.16 147.79,168.91 147.79,102.87 146.74,101.82 146.74,100.89 147.22,100.41 | 147.22,100.41 MV3.2 | MAINCON.16 108.8,168.01 108.36,167.58 | 108.36,167.58 109.03,168.07 MAINCON.16 | 108.36,167.58 108.42,168.41 MAINCON.16 | 2.92,93.98 2.28,94.12 MV1.2 | 2.92,93.98 2.32,93.7 MV1.2 | 133.23,185.88 133.44,186.51 MV2.2 | 133.23,185.88 133.02,186.51 MV2.2 | 147.22,100.41 147.52,99.81 MV3.2 | 147.22,100.41 147.82,100.11 MV3.2
MV1  (via drill 0.3, 0.35)
  Top 0.61: MV1.1 2.93,92.4 | 2.93,92.4 33.36,92.4 v75.74,134.78 | MAINCON.19 104.37,170.27 | 104.37,170.27 104.97,169.67 104.97,166.87 105.45,166.39 106.5,166.39 v109.06,163.83 | 104.37,170.27 104.08,171.05 MAINCON.19 | 104.37,170.27 103.59,170.56 MAINCON.19 | 2.93,92.4 2.3,92.61 MV1.1 | 2.93,92.4 2.3,92.19 MV1.1
  Bottom 0.61: v75.74,134.78 93.27,152.31 93.48,152.53 95.26,154.31 102.9,154.31 105.25,156.65 | 105.25,156.65 | v109.06,163.83 109.06,160.46 105.25,156.65
MV2
  Top 0.33: MV2.1 134.73,187.28 | 134.73,187.28 134.73,188.96 133.82,189.87 117.31,189.87 105.25,177.8 | 105.25,177.8 | 105.25,177.8 105.25,170.27 106.23,169.29 | 106.23,169.29 106.26,169.26 MAINCON.18 | 106.23,169.29 105.82,168.66 MAINCON.18 | 106.23,169.29 106.68,168.69 MAINCON.18 | 134.73,187.28 134.42,186.76 MV2.1 | 134.73,187.28 135.04,186.76 MV2.1
MV3  (via drill 0.35)
  Top 0.61: MV3.1 148.22,101.91 | 148.22,101.91 148.3,101.99 148.3,162.69 143.86,167.13 121,167.13 120.24,167.89 120.24,173.03 119.63,173.63 v115.25,173.63 | 148.22,101.91 147.62,101.61 MV3.1 | 148.22,101.91 147.92,101.31 MV3.1
  Bottom 0.61: v115.25,173.63 106.83,173.63 106.26,173.07 106.26,171.83 | 106.26,171.83 MAINCON.17 | 106.26,171.83 105.91,171.08 MAINCON.17 | 106.26,171.83 106.61,171.08 MAINCON.17
MVS1  (via drill 0.3)
  Top 0.61: MV1.5 2.93,98.4 | 2.93,98.4 37.89,98.4 76.02,136.53 v81.12,136.53 | 2.93,98.4 2.3,98.61 MV1.5 | 2.93,98.4 2.3,98.19 MV1.5
  Bottom 0.61: 126.14,170.12 125.57,169.54 117.95,169.54 117.63,169.23 117.63,166.69 103.73,152.78 97.38,152.78 v81.12,136.53 | 126.14,170.12 126.58,170.56 MAINCON.1 | 126.14,170.12 126.81,170.62 MAINCON.1 | 126.14,170.12 126.2,170.95 MAINCON.1
MVS2
  Bottom 0.61: 127.23,169.03 128.73,170.53 128.73,185.88 | 127.23,169.03 MAINCON.2 | MV2.5 128.73,185.88 | 127.23,169.03 126.45,168.74 MAINCON.2 | 127.23,169.03 126.94,168.25 MAINCON.2 | 128.73,185.88 128.94,186.51 MV2.5 | 128.73,185.88 128.52,186.51 MV2.5
MVS3
  Top 0.61: MV3.5 148.22,95.91 | 148.22,95.91 149.06,96.75 149.06,163.83 144.62,168.28 135.09,168.28 130.01,173.35 124.3,173.35 124.04,173.09 124.04,171.83 | 124.04,171.83 MAINCON.3 | 124.04,171.83 123.69,171.08 MAINCON.3 | 124.04,171.83 124.39,171.08 MAINCON.3 | 148.22,95.91 147.62,95.61 MV3.5 | 148.22,95.91 147.92,95.31 MV3.5
N$1
  Top 0.33: SW-ADDR.5 104.2,150.91 104.61,150.5 106.52,150.5 107.61,151.59 107.61,152.37 109.06,153.81 109.06,154.94 109.97,155.84 PCA9547.1
  Top 0.508: SW-R3.2 SW-ADDR.5
N$2
  Top 0.33: PCA9547.2 110.49,153.93 109.86,153.93 108.09,152.16 108.09,150.26 107.76,149.92 102.32,149.92 101.66,150.58 101.66,152.01
  Top 0.508: SW-R2.2 101.66,152.01 SW-ADDR.6
N$3  (via drill 0.35)
  Top 0.33: v120.93,151.55 121.2,151.81 121.2,152 | 121.2,152 PCA9547.21 | 121.2,152 120.83,151.67 v120.93,151.55 | 121.2,152 121.09,151.51 v120.93,151.55
  Top 0.508: SW-R1.2 SW-ADDR.7
  Top 0.61: SW-ADDR.7 99.12,150.25 v98.9,150.02
  Bottom 0.33: v98.9,150.02 98.9,149.54 98.89,149.53 98.89,149.5 | 98.89,149.5 98.89,149.22 | 98.89,149.22 | 98.89,149.22 98.89,148.99 99.27,148.62 103.32,148.62 103.34,148.59 104.61,148.59 106.2,150.18 106.52,150.5 | 106.52,150.5 107.16,151.13 | 107.16,151.13 | 106.52,150.5 | 107.16,151.13 107.58,151.55 120.41,151.55 | 120.41,151.55 v120.93,151.55 | 98.89,149.5 99.05,149.97 v98.9,150.02 | 98.89,149.5 98.75,149.97 v98.9,150.02 | 120.41,151.55 120.88,151.4 v120.93,151.55 | 120.41,151.55 120.88,151.7 v120.93,151.55
N$4
  Top 0.61: L2.C LED-R.2
N$5  (via drill 0.35)
  Top 0.33: PCA9547.3 109.92,153.31 108.58,151.97 108.58,150.06 107.77,149.25 107.05,149.25 | 107.05,149.25 106.53,149.25 v106.52,149.26 | v107.79,137.79 107.93,137.65 108.3,137.65 | 108.3,137.65 RES-R.2 | 107.05,149.25 106.57,149.41 v106.52,149.26 | 107.05,149.25 106.57,149.1 v106.52,149.26 | 108.3,137.65 107.88,137.93 v107.79,137.79 | 108.3,137.65 107.8,137.63 v107.79,137.79
  Bottom 0.33: v106.52,149.26 106.15,148.89 | 106.15,148.89 105.89,148.62 105.89,139.7 107.42,138.17 | 107.42,138.17 v107.79,137.79 | 106.15,148.89 106.59,149.12 v106.52,149.26 | 106.15,148.89 106.38,149.33 v106.52,149.26 | 107.42,138.17 107.64,137.72 v107.79,137.79 | 107.42,138.17 107.86,137.94 v107.79,137.79
N$6  (via drill 4.3 pad 8)
  other vias: 62,186.72
N$7
  Top 0.33: L1.C 99.96,161.34 LED-R1.2
N$8
  Top 0.33: L1.A 98.64,164.76 98.64,167.47 | MAINCON.24 98.64,167.47 | 98.64,167.47 99.07,168.08 MAINCON.24 | 98.64,167.47 98.21,168.08 MAINCON.24
N$9
  Top 0.61: L3.C 58.7,162.47 LED-R2.2
N$10
  Top 0.61: MOTORDRIVER.11 55.23,168.59 | 55.23,168.59 55.23,165.59 L3.A | 55.23,168.59 55.58,169.34 MOTORDRIVER.11 | 55.23,168.59 54.88,169.34 MOTORDRIVER.11
N$11  (via drill 4.3 pad 8)
  other vias: 62,8
N$12  (via drill 4.3 pad 8)
  other vias: 88,8
N$13  (via drill 4.3 pad 8)
  other vias: 48,8
N$14  (via drill 4.3 pad 8)
  other vias: 102,8
N$15  (via drill 4.3 pad 8)
  other vias: 102,186.72
N$16  (via drill 4.3 pad 8)
  other vias: 88,186.72
N$17  (via drill 4.3 pad 8)
  other vias: 48,186.72
PING1  (via drill 0.3)
  Top 0.61: PING1.P$1 3.06,24.72 2.38,25.4 2.38,60.33 2.38,78 7.92,83.54 | v76.67,134.63 25.58,83.54 8.1,83.54 | 7.92,83.54 8.1,83.54 | 8.1,83.54 7.92,83.54
  Bottom 0.61: MAINCON.13 110.44,170.92 110.43,170.91 | 110.43,170.91 110.01,170.5 110.01,160.34 103.22,153.54 95.58,153.54 v76.67,134.63 | 110.43,170.91 111.19,170.57 MAINCON.13 | 110.43,170.91 111.18,171.26 MAINCON.13
PING2  (via drill 0.35)
  Top 0.61: 109.47,191.55 74.55,191.55 64.61,181.61 31.57,181.61 8.1,158.13 8.1,151.13 6.16,149.19 PING2.P$1 | 113.23,169.03 112.63,169.63 v112.63,182.14 | 113.23,169.03 MAINCON.12 | 109.47,191.55 | v112.6,186.84 112.6,188.42 109.47,191.55 | 113.23,169.03 113.52,168.25 MAINCON.12 | 113.23,169.03 114.01,168.74 MAINCON.12
  Bottom 0.61: v112.63,182.14 112.63,186.82 v112.6,186.84
PING3  (via drill 0.35)
  Top 0.61: PING3.P$1 35.43,188.62 39.21,192.41 109.69,192.41 v114.14,187.96 | MAINCON.11 114.14,171.18 114.14,171.8 | 114.14,171.8 v114.14,183.51 | 114.14,171.8 113.59,171.17 MAINCON.11 | 114.14,171.8 114.26,170.97 MAINCON.11
  Bottom 0.61: v114.14,183.51 v114.14,187.96
PING4
  Top 0.61: PING4.P$1 144.45,158.28 137.27,165.47 118.97,165.47 116.86,167.58 | 116.86,167.58 116.42,168.01 MAINCON.10 | 116.86,167.58 116.8,168.41 MAINCON.10 | 116.86,167.58 116.19,168.07 MAINCON.10
PING5
  Top 0.61: PING5.P$1 145.89,31.24 145.89,147.32 147.16,148.59 147.16,161.29 142.08,166.37 119.33,166.37 117.59,168.11 117.59,169.75 117.07,170.27 | MAINCON.9 117.07,170.27 | 117.07,170.27 116.78,171.05 MAINCON.9 | 117.07,170.27 116.29,170.56 MAINCON.9
PING6  (via drill 0.35)
  Top 0.61: v116.05,139.95 v116.05,157.87
  Bottom 0.61: PING6.P$1 114.54,131.04 116.05,132.55 v116.05,139.95 | MAINCON.8 118.96,167.47 | 118.96,167.47 118.96,167 118.96,162.3 116.05,159.38 v116.05,157.87 | 118.96,167.47 119.31,168.22 MAINCON.8 | 118.96,167.47 118.61,168.22 MAINCON.8
RANGE
  Bottom 0.61: 118.9,171.83 118.9,173.04 117.52,174.42 106.53,174.42 105.22,173.11 97.41,173.11 96.44,174.07 96.44,174.16 | 118.9,171.83 118.9,170.98 MAINCON.7 | CN2.6 96.44,174.16 | 118.9,171.83 118.6,171.06 MAINCON.7 | 118.9,171.83 119.3,171.1 MAINCON.7 | 96.44,174.16 96.65,174.78 CN2.6 | 96.44,174.16 96.23,174.78 CN2.6
RO1
  Bottom 0.61: MAINCON.25 96,170.81 95.19,170.81 | 95.19,170.81 95.09,170.81 94.45,170.18 94.45,163.25 85.55,154.35 79.39,154.35 | RO1.P$3 79.39,154.35 | 95.19,170.81 95.98,170.56 MAINCON.25 | 95.19,170.81 95.9,171.25 MAINCON.25 | 79.39,154.35 78.48,154.87 RO1.P$3 | 79.39,154.35 78.48,153.83 RO1.P$3
RO2  (via drill 0.35)
  Top 0.61: v97.63,150.5 97.61,150.52 97.61,153.12 96.1,154.63 96.1,167.47 | MAINCON.26 96.1,167.47 | 96.1,167.47 96.45,168.22 MAINCON.26 | 96.1,167.47 95.75,168.22 MAINCON.26
  Bottom 0.61: 94.45,31.35 94.45,33.02 96.11,34.67 96.11,110.72 97.63,112.24 v97.63,150.5 | 94.45,31.35 94.45,30.2 RO2.P$3 | 94.45,31.35 93.98,30.42 RO2.P$3 | 94.45,31.35 95.01,30.47 RO2.P$3
SCKD  (via drill 0.35)
  Top 0.33: MV2.4 130.23,187.28 | 130.23,187.28 130.23,187.75 129.86,188.11 117.61,188.11 110.33,180.83 110.33,169.39 110.69,169.03 | MAINCON.14 111.2,168.51 110.69,169.03 | 110.69,169.03 110.83,168.29 MAINCON.14 | 110.69,169.03 111.43,168.89 MAINCON.14 | 130.23,187.28 129.92,186.76 MV2.4 | 130.23,187.28 130.54,186.76 MV2.4
  Top 0.61: v105.77,167.17 110.5,167.17 110.9,167.58 | 111.2,168.51 111.2,167.88 110.9,167.58 | 110.9,167.58 111.57,168.07 MAINCON.14 110.96,168.41 110.9,167.58
  Bottom 0.61: MV1.4 2.93,96.9 | 2.93,96.9 29.18,96.9 82.27,149.99 94.65,162.37 98.27,165.99 104.61,165.99 105.77,167.15 v105.77,167.17 | MV3.4 148.22,97.41 | 148.22,97.41 148.7,97.89 148.7,101.82 148.56,101.96 148.56,177.48 143.03,183.01 138.14,183.01 136.37,184.78 136.37,187.96 135.73,188.59 131.28,188.59 130.23,187.54 130.23,187.28 | 130.23,187.28 MV2.4 | 2.93,96.9 2.3,97.11 MV1.4 | 2.93,96.9 2.3,96.69 MV1.4 | 130.23,187.28 130.02,186.65 MV2.4 | 130.23,187.28 130.44,186.65 MV2.4 | 148.22,97.41 147.62,97.11 MV3.4 | 148.22,97.41 147.92,96.81 MV3.4
SCL0
  Top 0.33: VL01.2 10.48,37.31 9.37,36.2 9.37,34.29 10,33.66 13.18,33.66 18.74,39.22 18.74,70.83 93.15,145.24 107.33,145.24 109.42,143.15 PCA9547.11 112.42,143.15 112.75,142.82 SERMO-R1.4
SCL1  (via drill 0.35)
  Top 0.33: v67.78,137.16 68.31,137.16 | 68.31,137.16 82.34,137.16 92.35,147.17 108.42,147.17 109.47,148.22 PCA9547.7 112.5,148.22 114.51,150.23 VL-R1.4 | 68.31,137.16 67.84,137.31 v67.78,137.16 | 68.31,137.16 67.84,137.01 v67.78,137.16
  Bottom 0.33: VL02.2 11.72,139.88 14.45,137.16 67.26,137.16 | 67.26,137.16 v67.78,137.16 | 67.26,137.16 67.73,137.01 v67.78,137.16 | 67.26,137.16 67.73,137.31 v67.78,137.16
SCL2
  Top 0.33: VL03.2 74.29,183.87 74.29,182.71 79.22,177.79 79.23,177.79 84.93,172.09 84.93,158.12 84.93,155.75 92.55,148.13 108.02,148.13 109.54,149.66 109.54,150.34 109.97,150.76 PCA9547.5 112.5,150.76 113.38,151.64 VL-R1.2
SCL3
  Top 0.33: VL-R2.2 118.72,142.38 119.49,143.15 120.49,143.15 PCA9547.14 122.12,143.15 125.18,146.2 136.16,146.2 136.94,145.41 136.94,144.29 VL04.2
SCL4
  Top 0.33: VL05.2 137.18,40.18 137.14,40.14 135.58,41.7 135.58,101.44 142.23,108.09 142.23,108.1 142.26,108.13 142.26,146.65 140.25,148.66 123.74,148.66 123.3,148.22 PCA9547.18 119.58,148.22 118.23,149.58 VL-R3.2
SCL5
  Top 0.33: VL06.2 76.46,8.47 76.67,8.26 79.85,8.26 81.12,9.53 81.12,13.34 83.03,15.24 116.29,15.24 134.61,33.56 134.61,47.62 134.61,48.26 134.61,101.85 141.29,108.53 141.29,146.25 140.22,147.32 124.94,147.32 123.3,145.69 PCA9547.16 119.49,145.69 117.6,143.79 VL-R2.4
SCL6
  Top 0.33: SERMO1.2 8,82.47 7.1,81.57 7.1,79.69 8.08,78.72 10.02,78.72 11.88,80.57 27.12,80.57 92.75,146.2 108.91,146.2 109.42,145.69 110.97,145.69 PCA9547.9 112.6,145.69 113.87,144.41 SERMO-R1.2
SCL7
  Top 0.33: SERMO2.2 142.48,85.11 143.22,85.85 143.22,147.05 140.54,149.73 123.79,149.73 122.76,150.76 PCA9547.20 119.86,150.76 119.36,151.27 VL-R3.4
SCL-D
  Top 0.61: 128.11,162.56 128.11,154.31 127.11,153.31 | 127.11,153.31 PCA9547.22 | 127.11,153.31 128.65,151.76 133.19,151.76 133.86,152.43 I2C-R1.1 | 130.4,162.16 130.01,162.56 128.11,162.56 | 130.4,162.16 I2C-R.P$4 | MAINCON.20 103.72,167.47 | 103.72,167.47 103.72,164.09 105.25,162.56 128.11,162.56 | 103.72,167.47 104.07,168.22 MAINCON.20 | 103.72,167.47 103.37,168.22 MAINCON.20 | 130.4,162.16 130.68,161.16 I2C-R.P$4 | 130.4,162.16 131.41,161.89 I2C-R.P$4
SDA0
  Top 0.33: VL01.1 13.61,34.77 18.26,39.42 18.26,40.4 18.26,40.64 18.26,71.03 92.95,145.72 108.12,145.72 109.42,144.41 110.97,144.41 PCA9547.10 112.6,144.41 113.37,143.64 SERMO-R1.3
SDA1  (via drill 0.35)
  Top 0.33: v67.15,137.81 67.67,137.81 | 67.67,137.81 68.41,137.81 68.57,137.64 82.14,137.64 92.15,147.65 108.22,147.65 110.06,149.5 PCA9547.6 112.5,149.5 113.88,150.87 VL-R1.3 | 67.67,137.81 67.2,137.96 v67.15,137.81 | 67.67,137.81 67.2,137.65 v67.15,137.81
  Bottom 0.33: VL02.1 9.19,137.34 8.4,138.12 8.4,140.25 9.25,141.1 11.78,141.1 15.08,137.79 66.62,137.79 | 66.62,137.79 v67.14,137.79 v67.15,137.81 | 66.62,137.79 67.1,137.65 v67.15,137.81 | 66.62,137.79 67.1,137.96 v67.15,137.81
SDA2
  Top 0.33: VL03.1 71.14,185.6 72.14,186.6 74.22,186.6 74.77,186.06 74.77,182.91 79.41,178.27 79.44,178.27 85.49,172.22 85.49,155.88 92.75,148.62 107.81,148.62 109.06,149.86 109.06,151.76 109.33,152.03 PCA9547.4 112.57,152.03 112.78,152.25 112.78,157.73 VL-R1.1
SDA3
  Top 0.33: VL04.1 139.66,145.29 140.18,144.78 140.18,142.24 139.54,141.6 137.63,141.6 136.37,142.88 136.37,145.31 135.96,145.72 126.2,145.72 122.36,141.88 PCA9547.13 119.8,141.88 119.35,141.43 VL-R2.1
SDA4
  Top 0.33: VL05.1 139.37,42.72 140.18,41.91 140.18,39.37 139.77,38.96 137.63,38.96 135.09,41.5 135.09,101.65 141.78,108.33 141.78,146.45 140.22,148 124.35,148 123.3,146.96 121.76,146.96 PCA9547.17 119.58,146.96 117.61,148.93 VL-R3.1
SDA5
  Top 0.33: VL06.1 80.64,11.71 80.64,13.54 82.83,15.72 116.09,15.72 134.13,33.76 134.13,102.05 139.47,107.39 139.7,107.62 140.81,108.73 140.81,146.05 140.18,146.69 124.98,146.69 122.71,144.41 PCA9547.15 119.49,144.41 118.22,143.15 VL-R2.3
SDA6
  Top 0.33: SERMO1.1 10.55,79.93 11.68,81.05 25.24,81.05 25.45,81.05 26.92,81.05 92.55,146.69 108.61,146.69 108.89,146.96 PCA9547.8 112.6,146.96 114.5,145.06 SERMO-R1.1
SDA7
  Top 0.33: SERMO2.1 142.1,87.65 142.72,88.27 142.72,107.9 142.74,107.93 142.74,146.85 140.34,149.25 123.59,149.25 123.35,149.5 121.76,149.5 PCA9547.19 119.58,149.5 118.73,150.35 VL-R3.3
SDA-D  (via drill 0.35)
  Top 0.61: MAINCON.21 101.83,170.27 | 101.83,170.27 102.52,169.58 102.52,164.02 104.74,161.8 126.33,161.8 126.84,161.29 v126.84,159.38 126.84,156.21 125.2,154.57 PCA9547.23 | I2C-R.P$3 132.94,160.47 | 132.94,160.47 131.23,158.75 130.01,158.75 128.87,157.61 128.87,154.81 129.59,154.09 I2C-R2.1 | 101.83,170.27 101.54,171.05 MAINCON.21 | 101.83,170.27 101.05,170.56 MAINCON.21 | 132.94,160.47 133.95,160.74 I2C-R.P$3 | 132.94,160.47 133.22,161.47 I2C-R.P$3
  Bottom 0.61: v126.84,159.38 133.19,159.38 133.79,159.99 133.79,160.11 | I2C-R.P$3 133.79,160.11 | 133.79,160.11 134.31,161.02 I2C-R.P$3 | 133.79,160.11 133.28,161.02 I2C-R.P$3

### Text on the board
tPlace: SIG | 3.3 | 5 | G | 9 | SIG | SIG | SIG | SIG | SIG
bPlace: G | SIG | SIG | G
tValues: Designed by Aquila | 2018 | Project Aquila | Designed by Aquila